# Altium schematic sheet ScannerV2.SchDoc
size A3
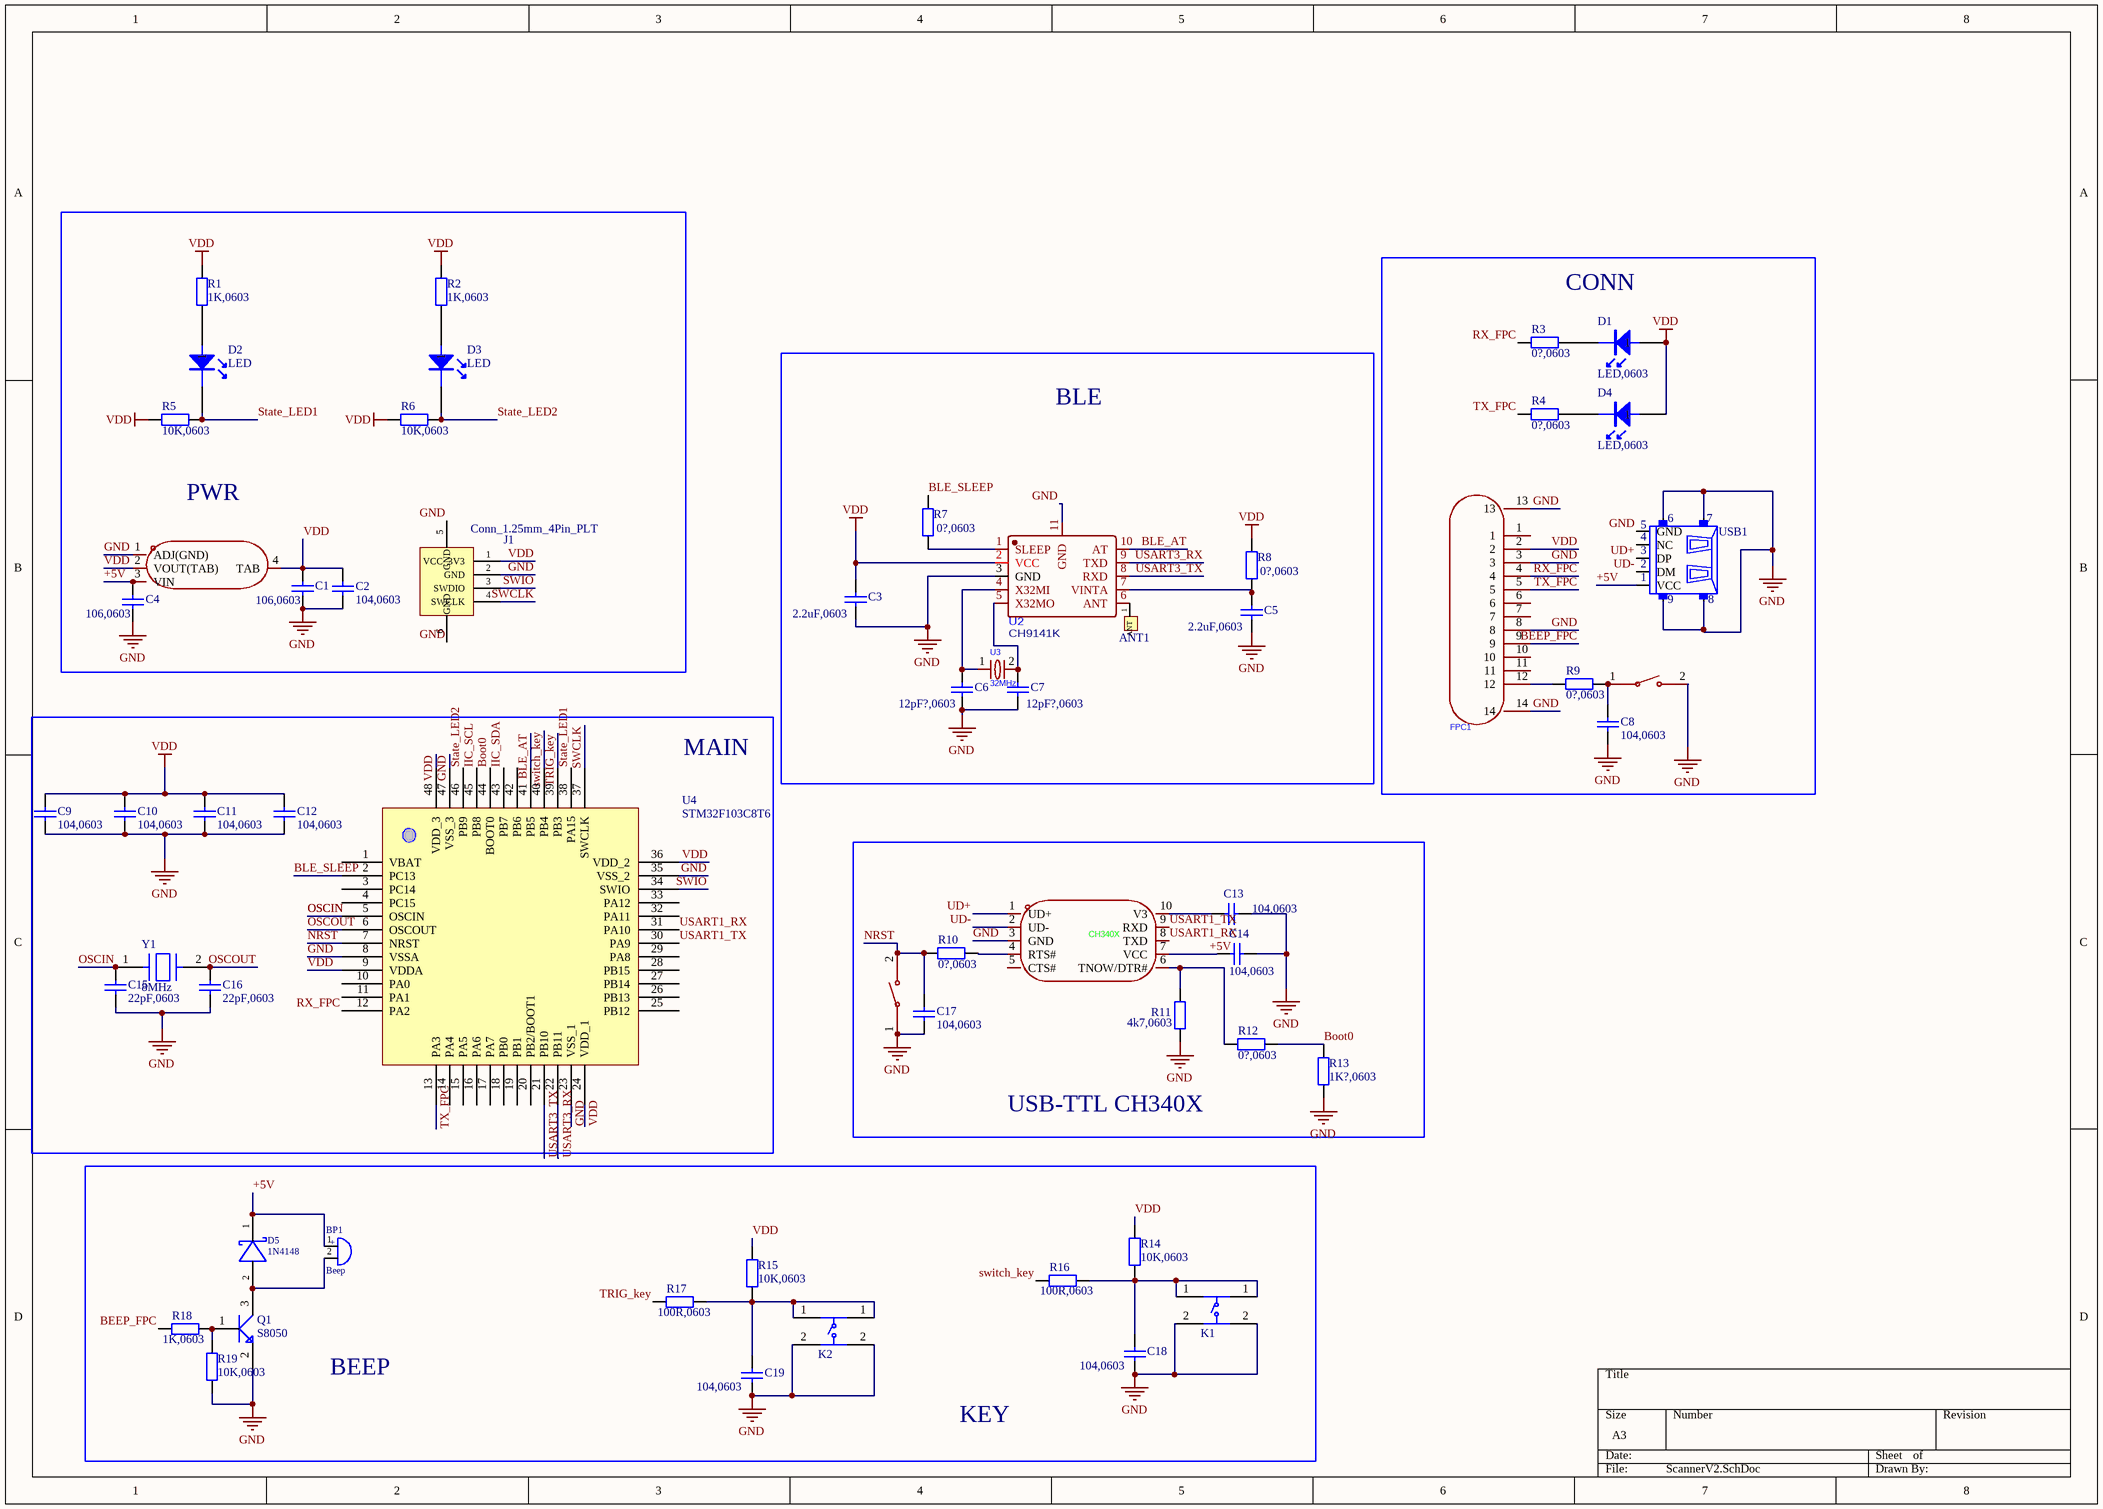
[diagram p0: ScannerV2.SchDoc]

## Parts
ANT1  ANT  [IPX-2.0]  (value not drawn)
BP1  Beep  [BEEP]
C1  106,0603  [C0603]
C2  104,0603  [C0603]
C3  2.2uF,0603  [C0603]
C4  106,0603  [C0603]
C5  2.2uF,0603  [C0603]
C6  12pF?,0603  [C0603]
C7  12pF?,0603  [C0603]
C8  104,0603  [C0603]
C9  104,0603  [C0603]
C10  104,0603  [C0603]
C11  104,0603  [C0603]
C12  104,0603  [C0603]
C13  104,0603  [C0603]
C14  104,0603  [C0603]
C15  22pF,0603  [C0603]
C16  22pF,0603  [C0603]
C17  104,0603  [C0603]
C18  104,0603  [C0603]
C19  104,0603  [C0603]
D1  LED,0603  [LED0603]
D2  LED  [LED-2.5mm]
D3  LED  [LED-2.5mm]
D4  LED,0603  [LED0603]
D5  1N4148  [1N4148]
FPC1  AFC01-S12FCA-00  [CONN-SMD-12P_AFC11-S12ICA-00]  (value not drawn)
J1  Conn_1.25mm_4Pin_PLT  [CONN-SMD_4P-P1.25_HCTL_HC-1.25-4PLT]
K1  TS665CJ  [KEY12*12]  (value not drawn)
K2  TS665CJ  [KEY12*12]  (value not drawn)
Q1  S8050  [S8050]
R1  1K,0603  [R0603]
R2  1K,0603  [R0603]
R3  0?,0603  [R0603]
R4  0?,0603  [R0603]
R5  10K,0603  [R0603]
R6  10K,0603  [R0603]
R7  0?,0603  [R0603]
R8  0?,0603  [R0603]
R9  0?,0603  [R0603]
R10  0?,0603  [R0603]
R11  4k7,0603  [R0603]
R12  0?,0603  [R0603]
R13  1K?,0603  [R0603]
R14  10K,0603  [R0603]
R15  10K,0603  [R0603]
R16  100R,0603  [R0603]
R17  100R,0603  [R0603]
R18  1K,0603  [R0603]
R19  10K,0603  [R0603]
SW1  K2-1107ST-A4DW-06  [KEY-SMD_L6.2-W3.6-LS8.0]  (value not drawn)
SW2  K2-1107ST-A4DW-06  [KEY-SMD_L6.2-W3.6-LS8.0]  (value not drawn)
U1  AMS1117-3.3  [SOT-223-4_L6.5-W3.5-P2.30-LS7.0-BR]  (value not drawn)
U2  CH9141K  [CH9141K]
U3  32MHz  [32MHz_2016]
U4  STM32F103C8T6  [LQFP-48_L7.0-W7.0-P0.50-LS9.0-BL]
U5  CH340X  [CH340X]
USB1  USB-5PIN  [MICRO-USB-SMD_MICROXNJ]  (value not drawn)
Y1  8MHz  [8MHz]

## Blocks framed on the sheet
PWR: C1 C2 C4 D2 D3 J1 R1 R2 R5 R6 U1
CONN: C8 D1 D4 FPC1 R3 R4 R9 SW1 USB1
BLE: ANT1 C3 C5-C7 R7 R8 U2 U3
MAIN: C9-C12 C15 C16 U4 Y1
USB-TTL CH340X: C13 C14 C17 R10-R13 SW2 U5

## Nets
GND: C1.1 C2.1 C3.2 C4.1 C5.2 C6.2 C7.2 C8.1 C9.1 C10.1 C11.1 C12.1 C13.2 C14.2 C15.1 C16.1 C17.2 C18.1 C19.1 FPC1.3 FPC1.8 FPC1.13 FPC1.14 J1.2(GND) J1.5(GND) J1.6(GND) K1.2 K2.2 Q1.2 R11.2 R13.2 R19.2 SW1.2 SW2.1 U1.1(ADJ(GND)) U2.3(GND) U2.11(GND) U4.8(VSSA) U4.23(VSS_1) U4.35(VSS_2) U4.47(VSS_3) U5.3(GND) USB1.5(GND) USB1.6 USB1.7 USB1.8 USB1.9
VDD: C1.2 C2.2 C3.1 C9.2 C10.2 C11.2 C12.2 D1.1 D4.1 FPC1.2 J1.1(VCC_3V3) R1.2 R2.2 R5.2 R6.2 R8.2 R14.2 R15.2 U1.2(VOUT(TAB)) U1.4(TAB) U2.2(VCC) U4.9(VDDA) U4.24(VDD_1) U4.36(VDD_2) U4.48(VDD_3)
+5V: BP1.1 C4.2 C14.1 D5.1 U1.3(VIN) U5.7(VCC) USB1.1(VCC)
BEEP_FPC: FPC1.9 R18.1
BLE_AT: U2.10(AT) U4.41(PB5)
BLE_SLEEP: R7.2 U4.2(PC13)
Boot0: R12.1 R13.1 U4.44(BOOT0)
IIC_SCL: U4.45(PB8)
IIC_SDA: U4.43(PB7)
NRST: C17.1 R10.2 SW2.2 U4.7(NRST)
OSCIN: C15.2 U4.5(OSCIN) Y1.1
OSCOUT: C16.2 U4.6(OSCOUT) Y1.2
RX_FPC: FPC1.4 R3.2 U4.12(PA2)
State_LED1: D2.2 R5.1 U4.38(PA15)
State_LED2: D3.2 R6.1 U4.46(PB9)
SWCLK: J1.4(SWCLK) U4.37(SWCLK)
SWIO: J1.3(SWDIO) U4.34(SWIO)
switch_key: R16.1 U4.40(PB4)
TRIG_key: R17.1 U4.39(PB3)
TX_FPC: FPC1.5 R4.2 U4.13(PA3)
UD+: U5.1(UD+) USB1.3(DP)
UD-: U5.2(UD-) USB1.2(DM)
USART1_RX: U4.31(PA10) U5.8(TXD)
USART1_TX: U4.30(PA9) U5.9(RXD)
USART3_RX: U2.9(TXD) U4.22(PB11)
USART3_TX: U2.8(RXD) U4.21(PB10)
NetANT1_1: ANT1.1(ANT) U2.6(ANT)
NetBP1_2: BP1.2 D5.2 Q1.3
NetC5_1: C5.1 R8.1 U2.7(VINTA)
NetC6_1: C6.1 U2.4(X32MI) U3.1
NetC7_1: C7.1 U2.5(X32MO) U3.2(GND)
NetC8_2: C8.2 R9.1 SW1.1
NetC13_1: C13.1 U5.10(V3)
NetC18_2: C18.2 K1.1 R14.1 R16.2
NetC19_2: C19.2 K2.1 R15.1 R17.2
NetD1_2: D1.2 R3.1
NetD2_1: D2.1 R1.1
NetD3_1: D3.1 R2.1
NetD4_2: D4.2 R4.1
NetFPC1_12: FPC1.12 R9.2
NetQ1_1: Q1.1 R18.2 R19.1
NetR7_1: R7.1 U2.1(SLEEP)
NetR10_1: R10.1 U5.4(RTS#)
NetR11_1: R11.1 R12.2 U5.6(TNOW/DTR#)

Not connected (* = marked no-connect by the designer): FPC1 1 6 7 10 11; U4 1(VBAT) 3(PC14) 4(PC15) 10(PA0) 11(PA1) 14(PA4) 15(PA5) 16(PA6) 17(PA7) 18(PB0) 19(PB1) 20(PB2/BOOT1) 25(PB12) 26(PB13) 27(PB14) 28(PB15) 29(PA8) 32(PA11) 33(PA12) 42(PB6); U5 5(CTS#); USB1 4(NC)

## Notes on the sheet
- BEEP
- KEY
- (in symbol Beep) +

## Library data of the parts
ANT1 = ANT_IPX
C1-C19 = Cap2: 105,0603; Value: 104; Published: 8-Jun-2000; LatestRevisionDate: 17-Jul-2002; LatestRevisionNote: Re-released for DXP Platform.; Publisher: Altium Limited
D1 D4 = LED0603
D5 = 1N4148: SOD-123
FPC1 = FPC-12Pin_0.5: Manufacturer: JS(钜硕电子); Add into BOM: yes; Locking Feature: 翻盖式; Number of Contacts: 12P; Pitch: 0.5mm; FFC, FCB Thickness: 0.3mm; Symbol: AFC01-S12FCA-00; Device: AFC01-S12FCA-00; LCSC Part Name: 间距:0.5mm P数:12P 翻盖式 下接; Supplier Part: C262661; Manufacturer Part: AFC01-S12FCA-00; Supplier Footprint: SMD,P=0.5mm,卧贴; JLCPCB Part Class: Extended Part; Datasheet: https://atta.szlcsc.com/upload/public/pdf/source/20190816/C413942_2A72D1AC756EAE17EEDF756A339D4500.pdf; Supplier: LCSC; Convert to PCB: yes; Contact Type: 下接; Mounting Type: 卧贴; Height Above Board: 2mm
J1 = Conn_1.25mm_4Pin_PLT: SWD_Conn
K1 K2 = TS665CJ: 矩阵按键
R1-R19 = Res2: 0603; Published: 8-Jun-2000; LatestRevisionDate: 17-Jul-2002; LatestRevisionNote: Re-released for DXP Platform.; Publisher: Altium Limited
SW1 SW2 = K2-1107ST-A4DW-06: Manufacturer: 韩国韩荣; Symbol: K2-1107ST-A4SW-06; Add into BOM: yes; Circuit: 单刀单掷; Actuator Style: 矩形按钮; Operating Force: 250gf; Switch Length: 6.1mm; Switch Width: 3.6mm; Switch Height: 2.5mm; Contact Current: 50mA; Voltage Rating (DC): 12V; Insulation Resistance: 100MΩ; Mechanical Life: 10万次; Device: K2-1107ST-A4DW-06; LCSC Part Name: 轻触开关 3.6*6.1*2.5; Supplier Part: C118141; Manufacturer Part: K2-1107ST-A4DW-06; Supplier Footprint: SMD; JLCPCB Part Class: Extended Part; Datasheet: https://atta.szlcsc.com/upload/public/pdf/source/20210810/381712CEF248770C072B585C3485C888.pdf; Supplier: LCSC; Convert to PCB: yes; Mounting Style: 立贴; With Lamp: -; Operating Temperature: -25℃~+85℃
U1 = AMS1117-3.3_C347222: Manufacturer: UMW(友台半导体); Add into BOM: yes; Output Type: 固定; Maximum Input Voltage: 12V; Output Voltage: 3.3V; Output Current: 1A; Power Supply Rejection Ratio (PSRR): 60dB@(120Hz); Dropout Voltage: 1.3V@(1A); Output Polarity: 正极; Number of Outputs: 1; Symbol: AMS1117-3.3_C347222; Device: AMS1117-3.3_C347222; LCSC Part Name: 输出:3.3V 电流:1A 耐压:12V; Supplier Part: C347222; Manufacturer Part: AMS1117-3.3; Supplier Footprint: SOT-223; JLCPCB Part Class: Extended Part; Datasheet: https://atta.szlcsc.com/upload/public/pdf/source/20241218/BAF0263FA2E44BCD8AF41AA4FA04EFAA.pdf; Supplier: LCSC; Convert to PCB: yes; standby current: -; Noise: -; Feature: 过流保护(OCP); Operating Temperature: -
U3 = 32kHz: pin to pad: 2>3; Manufacturer: HCI(杭晶); Symbol: FL26T2-32.000-NTLLLDTL; Add into BOM: yes; Crystal Type: 直插晶振; Value: 32kHz; Normal temperature Frequency Tolerance: ±20ppm; External load capacitor: 12.5pF; Device: FL26T2-32.000-NTLLLDTL; LCSC Part Name: 32kHz ±20ppm 12.5pF; Supplier Part: C3013591; Manufacturer Part: FL26T2-32.000-NTLLLDTL; Supplier Footprint: DT-26; JLCPCB Part Class: Extended Part; Datasheet: https://atta.szlcsc.com/upload/public/pdf/source/20220525/8CBD6E13DFF87AD7587DCBCECD93CD4C.pdf; Supplier: LCSC; Convert to PCB: yes; Frequency Stability(Full temperature range): ±20ppm; Operating Temperature: -40℃~+85℃
U5 = CH340X: Manufacturer: WCH(南京沁恒); Add into BOM: yes; Symbol: CH340X; Device: CH340X; LCSC Part Name: CH340X; Supplier Part: C3035748; Manufacturer Part: CH340X; Supplier Footprint: MSOP-10; JLCPCB Part Class: Extended Part; Datasheet: https://atta.szlcsc.com/upload/public/pdf/source/20230530/6E401E9554E9F5311886CC8B3F89B62E.pdf; Supplier: LCSC; Convert to PCB: yes
USB1 = USB-5PIN_PWR: with_PWR